# EAGLE design LIDAR_Breakout_V1.1 (EAGLE 9.2.2)
AUTHORS: Austin Keener, Peter Wilson, Johannes Kunz, Mukund Pandiri; REVISION: 1.0; SCH_DESC: Ethernet Breakout Board for Lidar Lite 3 Modules; TEAM: RoboRacing; TITLE: Lidar_Breakout
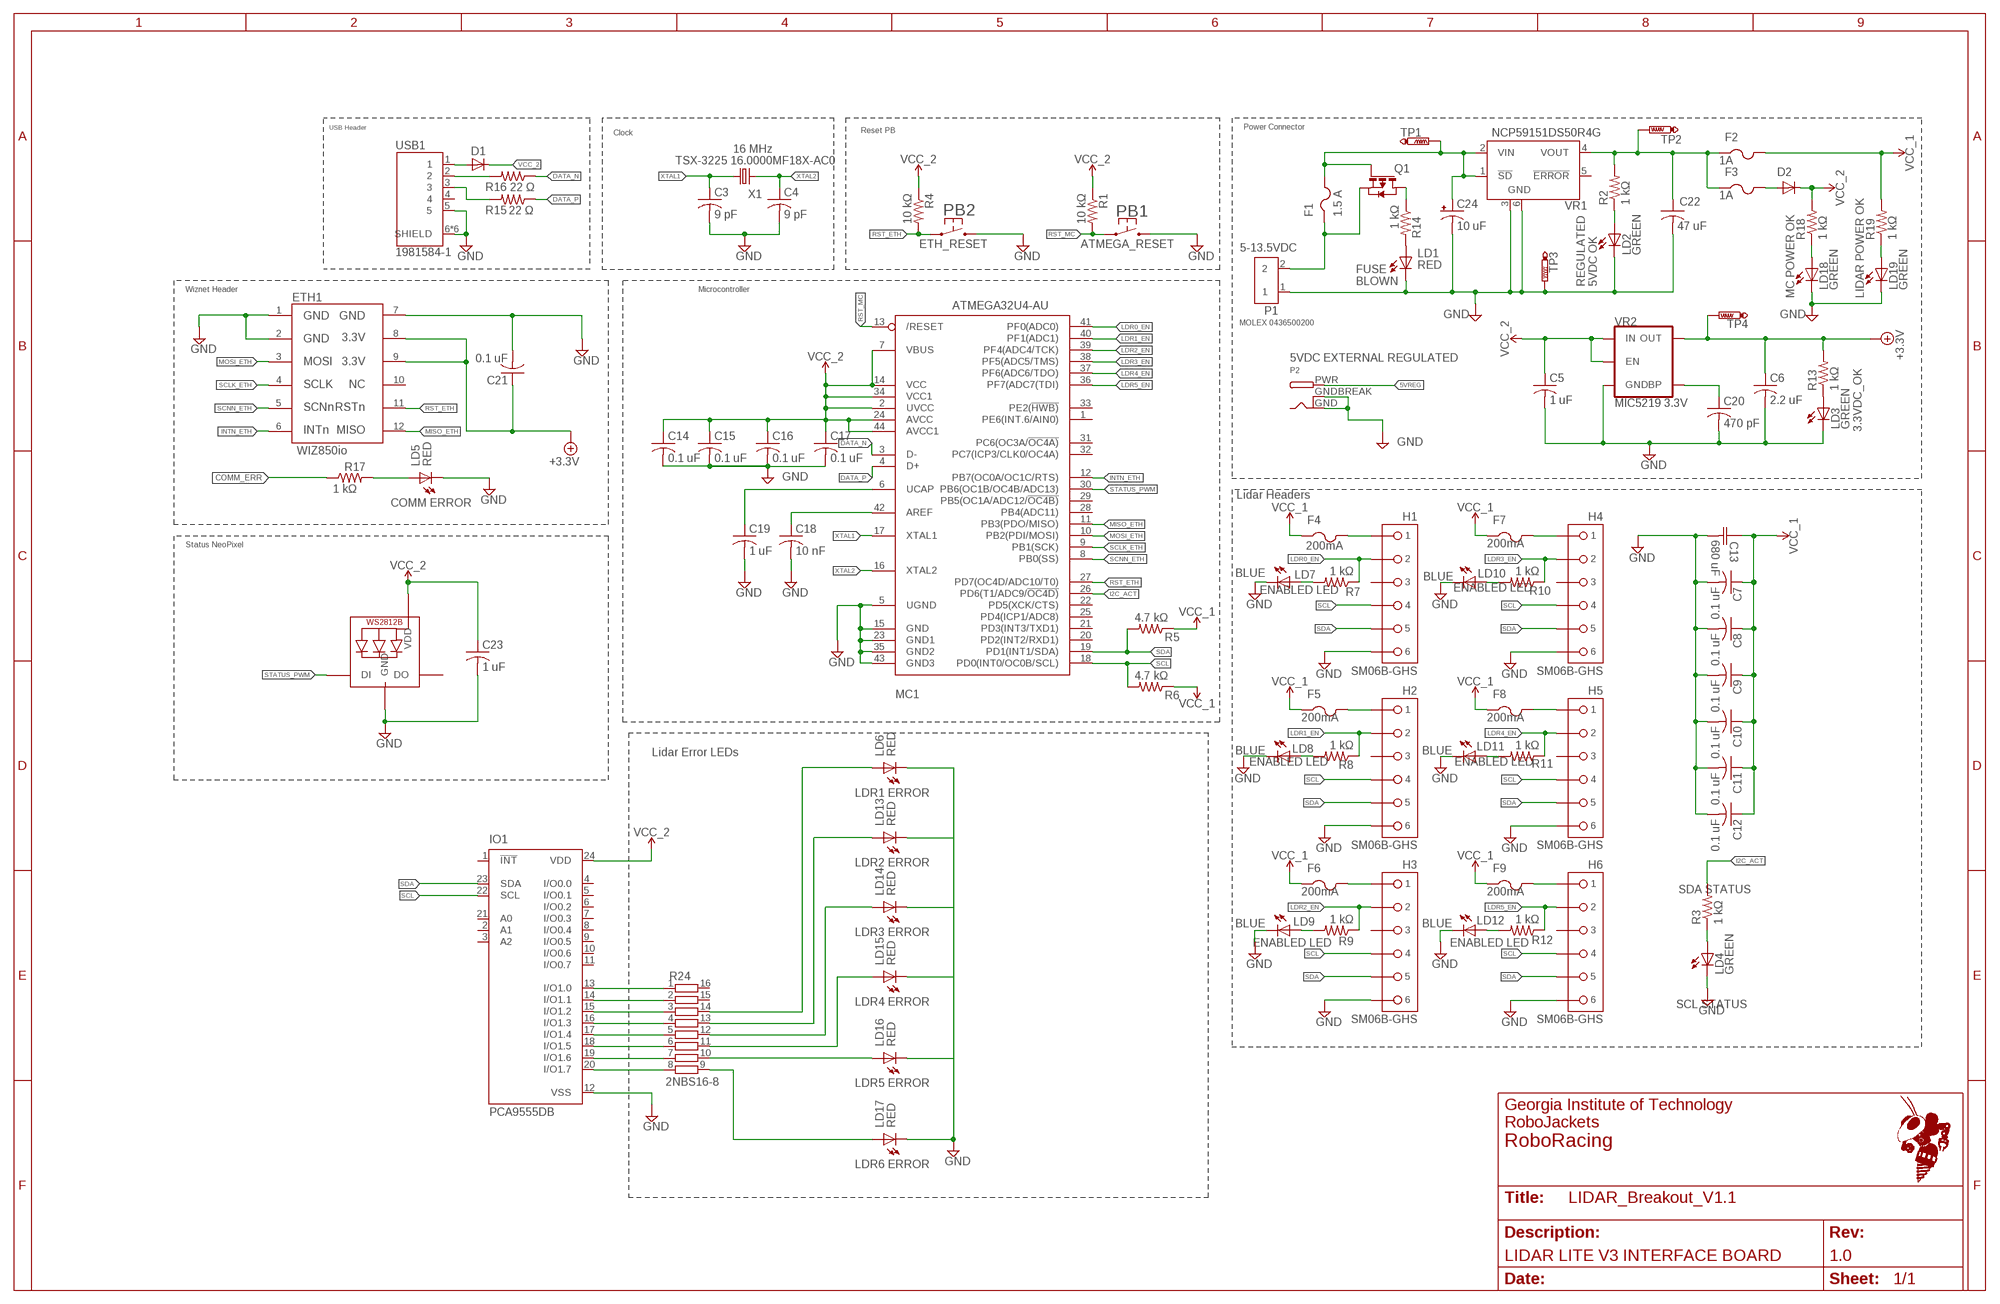
[diagram p0: schematic, sheet 1]
FRAME1 (FRAME_B_L): SCH_DESC: LIDAR LITE V3 INTERFACE BOARD

## Parts
C3  9 pF  C-USC0603  [C0603]
C4  9 pF  C-USC0603  [C0603]
C5  1 uF  C-USC0603  [C0603]
C6  2.2 uF  C-USC0603  [C0603]
C7  0.1 uF  C-USC0603  [C0603]
C8  0.1 uF  C-USC0603  [C0603]
C9  0.1 uF  C-USC0603  [C0603]
C10  0.1 uF  C-USC0603  [C0603]
C11  0.1 uF  C-USC0603  [C0603]
C12  0.1 uF  C-USC0603  [C0603]
C13  680 uF  EEE-FTJ681XAP  [CAP_PAN_EEE_D8]
C14  0.1 uF  C-USC0603  [C0603]
C15  0.1 uF  C-USC0603  [C0603]
C16  0.1 uF  C-USC0603  [C0603]
C17  0.1 uF  C-USC0603  [C0603]
C18  10 nF  C-USC0603  [C0603]
C19  1 uF  C-USC0603  [C0603]
C20  470 pF  C-USC0603  [C0603]
C21  0.1 uF  C-USC0603  [C0603]
C22  47 uF  C-USC0805  [C0805]
C23  1 uF  C-USC0603  [C0603]
C24  10 uF  CPOL-USE2-5  [E2-5]
D1  DIODE-DO-214AC  [DO-214AC]
D2  DIODE-DO-214AC  [DO-214AC]
ETH1  WIZ850IO  [WIZ850IO]
F1  1.5 A  PTCFUSE-1812  [1812]
F2  1A  PTCFUSE-1206  [R1206]
F3  1A  PTCFUSE-1206  [R1206]
F4  200mA  PTCFUSE-1206  [R1206]
F5  200mA  PTCFUSE-1206  [R1206]
F6  200mA  PTCFUSE-1206  [R1206]
F7  200mA  PTCFUSE-1206  [R1206]
F8  200mA  PTCFUSE-1206  [R1206]
F9  200mA  PTCFUSE-1206  [R1206]
H1  SM06B-GHS  [SM06B-GHS]
H2  SM06B-GHS  [SM06B-GHS]
H3  SM06B-GHS  [SM06B-GHS]
H4  SM06B-GHS  [SM06B-GHS]
H5  SM06B-GHS  [SM06B-GHS]
H6  SM06B-GHS  [SM06B-GHS]
IO1  PCA9555DB  [SSOP24]
LD1  RED  LED-SMD-RED  [CHIP-LED0603]
LD2  GREEN  LEDCHIP-LED0603  [CHIP-LED0603]
LD3  GREEN  LEDCHIP-LED0603  [CHIP-LED0603]
LD4  GREEN  LEDCHIP-LED0603  [CHIP-LED0603]
LD5  RED  LED-SMD-RED  [CHIP-LED0603]
LD6  RED  LED-SMD-RED  [CHIP-LED0603]
LD7  BLUE  LEDCHIP-LED0603  [CHIP-LED0603]
LD8  BLUE  LEDCHIP-LED0603  [CHIP-LED0603]
LD9  BLUE  LEDCHIP-LED0603  [CHIP-LED0603]
LD10  BLUE  LEDCHIP-LED0603  [CHIP-LED0603]
LD11  BLUE  LEDCHIP-LED0603  [CHIP-LED0603]
LD12  BLUE  LEDCHIP-LED0603  [CHIP-LED0603]
LD13  RED  LED-SMD-RED  [CHIP-LED0603]
LD14  RED  LED-SMD-RED  [CHIP-LED0603]
LD15  RED  LED-SMD-RED  [CHIP-LED0603]
LD16  RED  LED-SMD-RED  [CHIP-LED0603]
LD17  RED  LED-SMD-RED  [CHIP-LED0603]
LD18  GREEN  LEDCHIP-LED0603  [CHIP-LED0603]
LD19  GREEN  LEDCHIP-LED0603  [CHIP-LED0603]
LED1  WS2812B5050  [WS2812B]
MC1  ATMEGA32U4-AU  [TQFP44]
P1  MOLEX 0436500200  0436500200  [MOLEX_0436500200]
P2  DCBARRELPTH  [DCJACK_2MM_PTH]
PB1  ATMEGA_RESET  RESET_PB_RA  [RESET_PB_RA]
PB2  ETH_RESET  RESET_PB_RA  [RESET_PB_RA]
Q1  PMOS  [SOT-23-3]
R1  10 kΩ  R-US_R0603  [R0603]
R2  1 kΩ  R-US_R0603  [R0603]
R3  1 kΩ  R-US_R0603  [R0603]
R4  10 kΩ  R-US_R0603  [R0603]
R5  4.7 kΩ  R-US_R0603  [R0603]
R6  4.7 kΩ  R-US_R0603  [R0603]
R7  1 kΩ  R-US_R0603  [R0603]
R8  1 kΩ  R-US_R0603  [R0603]
R9  1 kΩ  R-US_R0603  [R0603]
R10  1 kΩ  R-US_R0603  [R0603]
R11  1 kΩ  R-US_R0603  [R0603]
R12  1 kΩ  R-US_R0603  [R0603]
R13  1 kΩ  R-US_R0603  [R0603]
R14  1 kΩ  R-US_R0603  [R0603]
R15  22 Ω  R-US_R0603  [R0603]
R16  22 Ω  R-US_R0603  [R0603]
R17  1 kΩ  R-US_R0603  [R0603]
R18  1 kΩ  R-US_R0603  [R0603]
R19  1 kΩ  R-US_R0603  [R0603]
R24  2NBS16-8  [SO16]
TP1  PTR1B1,27  [B1,27]
TP2  PTR1B1,27  [B1,27]
TP3  PTR1PAD1-13  [P1-13]
TP4  PTR1B1,27  [B1,27]
USB1  1981584-1  [TE_1981584-1]
VR1  NCP59151DS50R4G  LP3963ES-5.0  [TO263-5]
VR2  MIC5219 3.3V  V_REG_MIC52193.3V  [SOT23-5]
X1  TSX-3225 16.0000MF18X-AC0  XTAL-3.2X2.5  [XTAL-3.2X2.5]

## Nets
5VREG: C22.1 F2.1 F3.1 P2.PWR R2.2 TP2.TP VR1.4(VOUT)
+3.3V: C6.1 C21.1 ETH1.8 ETH1.9 R13.2 TP4.TP VR2.5(OUT)
AREF: C18.1 MC1.42(AREF)
COMM_ERR: R17.1
DATA_N [diff]: MC1.3(D-) R16.1
DATA_P [diff]: MC1.4(D+) R15.1
GND: C3.2 C4.2 C5.2 C6.2 C7.2 C8.2 C9.2 C10.2 C11.2 C12.2 C13.2 C14.2 C15.2 C16.2 C17.2 C18.2 C19.2 C20.2 C21.2 C22.2 C23.2 C24.- ETH1.1 ETH1.2 ETH1.7 H1.P$8 H2.P$8 H3.P$8 H4.P$8 H5.P$8 H6.P$8 IO1.12(VSS) LD1.C(K) LD2.C LD3.C LD4.C LD5.C(K) LD6.C(K) LD7.C LD8.C LD9.C LD10.C LD11.C LD12.C LD17.C(K) LD18.C LD19.C LED1.3-GND(GND) MC1.5(UGND) MC1.15(GND) MC1.23(GND1) MC1.35(GND2) MC1.43(GND3) P1.1 P2.GND P2.GNDBREAK PB1.P$3 PB2.P$3 TP3.TP USB1.5 USB1.6(SHIELD) USB1.7(SHIELD) USB1.8(SHIELD) USB1.9(SHIELD) USB1.10(SHIELD) USB1.11(SHIELD) VR1.3(GND) VR1.6(GND) VR2.2(GND)
I2C_ACT: MC1.26(PD6(T1/ADC9/!OC4D)) R3.2
INTN_ETH: ETH1.6 MC1.12(PB7(OC0A/OC1C/RTS))
LDR0_EN: H1.P$4 MC1.41(PF0(ADC0)) R7.1
LDR0_LED: LD7.A R7.2
LDR1_EN: H2.P$4 MC1.40(PF1(ADC1)) R8.1
LDR1_LED: LD8.A R8.2
LDR2_EN: H3.P$4 MC1.39(PF4(ADC4/TCK)) R9.1
LDR2_ERR: LD13.A R24.13
LDR2_LED: LD9.A R9.2
LDR3_EN: H4.P$4 MC1.38(PF5(ADC5/TMS)) R10.1
LDR3_LED: LD10.A R10.2
LDR4_EN: H5.P$4 MC1.37(PF6(ADC6/TDO)) R11.1
LDR4_LED: LD11.A R11.2
LDR5_EN: H6.P$4 MC1.36(PF7(ADC7(TDI)) R12.1
LDR5_LED: LD12.A R12.2
LDR6_ERR: LD6.A LD14.A LD15.A LD16.A LD17.A R24.9 R24.10 R24.11 R24.12 R24.14
MISO_ETH: ETH1.12 MC1.11(PB3(PDO/MISO))
MOSI_ETH: ETH1.3 MC1.10(PB2(PDI/MOSI))
N$1: D1.A USB1.1
N$2: LD4.A R3.1
N$3: LD2.A R2.1
N$4: Q1.3(D) R14.1
N$5: LD3.A R13.1
N$6: LD1.A R14.2
N$7: D2.A F3.2
N$8: R16.2 USB1.2
N$9: LD5.A R17.2
N$10: LD15.C(K)
N$11: LD18.A R18.1
N$12: LD19.A R19.1
N$16: LD16.C(K)
N$18: LD14.C(K)
N$19: LD13.C(K)
N$20: IO1.13(I/O1.0) R24.1
N$21: IO1.14(I/O1.1) R24.2
N$22: IO1.15(I/O1.2) R24.3
N$23: R15.2 USB1.3
N$24: IO1.16(I/O1.3) R24.4
N$25: IO1.17(I/O1.4) R24.5
N$26: IO1.18(I/O1.5) R24.6
N$27: IO1.19(I/O1.6) R24.7
N$28: IO1.20(I/O1.7) R24.8
N$31: C20.1 VR2.4(BP)
RST_ETH: ETH1.11 MC1.27(PD7(OC4D/ADC10/T0)) PB2.P$1 R4.2
RST_MC: MC1.13(/RESET) PB1.P$1 R1.2
SCL: H1.P$6 H2.P$6 H3.P$6 H4.P$6 H5.P$6 H6.P$6 IO1.22(SCL) MC1.18(PD0(INT0/OC0B/SCL)) R6.2
SCLK_ETH: ETH1.4 MC1.9(PB1(SCK))
SCNN_ETH: ETH1.5 MC1.8(PB0(SS))
SDA: H1.P$7 H2.P$7 H3.P$7 H4.P$7 H5.P$7 H6.P$7 IO1.23(SDA) MC1.19(PD1(INT1/SDA)) R5.2
STATUS_PWM: LED1.4-DIN(DI) MC1.30(PB6(OC1B/OC4B/ADC13))
UCAP: C19.1 MC1.6(UCAP)
UVCC: F1.1 P1.2 Q1.2(S)
VCC_1: C7.1 C8.1 C9.1 C10.1 C11.1 C12.1 C13.1 F2.2 F4.1 F5.1 F6.1 F7.1 F8.1 F9.1 R5.1 R6.1 R19.2
VCC_2: C5.1 C14.1 C15.1 C16.1 C17.1 C23.1 D1.C D2.C IO1.24(VDD) LED1.1-VDD(VDD) MC1.2(UVCC) MC1.7(VBUS) MC1.14(VCC) MC1.24(AVCC) MC1.34(VCC1) MC1.44(AVCC1) R1.1 R4.1 R18.2 VR2.1(IN) VR2.3(EN)
VCC_LDR0: F4.2 H1.P$3
VCC_LDR1: F5.2 H2.P$3
VCC_LDR2: F6.2 H3.P$3
VCC_LDR3: F7.2 H4.P$3
VCC_LDR4: F8.2 H5.P$3
VCC_LDR5: F9.2 H6.P$3
VIN: C24.+ F1.2 Q1.1(G) TP1.TP VR1.1(!SD) VR1.2(VIN)
XTAL1: C3.1 MC1.17(XTAL1) X1.1
XTAL2: C4.1 MC1.16(XTAL2) X1.3
Unconnected: ETH1.10 H1.P$5 H2.P$5 H3.P$5 H4.P$5 H5.P$5 H6.P$5 IO1.1(!INT) IO1.2(A1) IO1.3(A2) IO1.4(I/O0.0) IO1.5(I/O0.1) IO1.6(I/O0.2) IO1.7(I/O0.3) IO1.8(I/O0.4) IO1.9(I/O0.5) IO1.10(I/O0.6) IO1.11(I/O0.7) IO1.21(A0) LED1.2-DOUT(DO) MC1.1(PE6(INT.6/AIN0)) MC1.20(PD2(INT2/RXD1)) MC1.21(PD3(INT3/TXD1)) MC1.22(PD5(XCK/CTS)) MC1.25(PD4(ICP1/ADC8)) MC1.28(PB4(ADC11)) MC1.29(PB5(OC1A/ADC12/!OC4B)) MC1.31(PC6(OC3A/!OC4A)) MC1.32(PC7(ICP3/CLK0/OC4A)) MC1.33(PE2(!HWB)) R24.15 R24.16 USB1.4 VR1.5(!ERROR)

## Notes on the sheet
- USB Header | Power Connector
- Reset PB
- Clock
- 16 MHz
- 5-13.5VDC
- FUSE
  BLOWN
- REGULATED
  5VDC OK
- Wiznet Header | Microcontroller
- MC POWER OK | LIDAR POWER OK
- 5VDC EXTERNAL REGULATED
- 3.3VDC_OK
- Lidar Headers
- COMM ERROR
- Status NeoPixel
- ENABLED LED | ENABLED LED
- Lidar Error LEDs
- ENABLED LED | ENABLED LED
- LDR1 ERROR
- LDR2 ERROR
- SDA STATUS
- LDR3 ERROR
- ENABLED LED | ENABLED LED
- LDR4 ERROR | SCL STATUS
- LDR5 ERROR
- LDR6 ERROR

## Library data of the parts
C3-C12 C14-C21 = resistor:C-US: CAPACITOR, American symbol
C13 = 680uF_Elect_Cap:EEE-FTJ681XAP; MANUFACTURER_PART_NUMBER: EEEFTJ681XAP; VENDOR: Panasonic
C22 C23 = rcl:C-US: CAPACITOR, American symbol; SPICEPREFIX: C
C24 = rcl:CPOL-US: POLARIZED CAPACITOR, American symbol; SPICEPREFIX: C
D1 D2 = RoboJackets-Diodes:DIODE-: DIODE
ETH1 = WIZ850io:WIZ850IO
F1-F9 = adafruit:PTCFUSE: PTC fuses, resettable thermistors
H1-H6 = RoboJackets-Connectors:SM06B-GHS
IO1 = micro-philips:PCA9555: 16-bit I2C and SMBus I/O port with interrupt Source: PCA9555_5.pdf; MPN: PCA9555DB; OC_FARNELL: 1408295; OC_NEWARK: 63K6063
LD1 LD5 LD6 LD13-LD17 = RoboJackets-LEDs:LED-SMD; DIGIKEY: 160-1447-1-ND; MPN: LTST-C191KRKT
LD2-LD4 LD7-LD12 LD18 LD19 = led:LED: LED OSRAM: - CHIPLED LG R971, LG N971, LY N971, LG Q971, LY Q971, LO R971, LY R971 LH N974, LH R974 LS Q976, LO Q976, LY Q976 LO Q996 - Hyper CHIPLED LW Q18S LB Q993, LB Q99A, LB R99A - SideLED LS A670, LO A670, LY A670, LG A670, LP A670 LB A673, LV A673, LT A673, LW A673 LH A674 LY A675 LS A676, LA A676, LO A676, LY A676, LW A676 LS A679, LY A679, LG A679 - Hyper Micro SIDELED® LS Y876, LA Y876, LO Y876, LY Y876 LT Y87S - SmartLED LW L88C, LW L88S LB L89C, LB L89S, LG L890 LS L89K, LO L89K, LY L89K LS L896, LA L896, LO L896, LY L896 - TOPLED LS T670, LO T670, LY T670, LG T670, LP T670 LSG T670, LSP T670, LSY T670, LOP T670, LYG T670 LG T671, LOG T671, LSG T671 LB T673, LV T673, LT T673, LW T673 LH T674 LS T676, LA T676, LO T676, LY T676, LB T676, LH T676, LSB T676, LW T676 LB T67C, LV T67C, LT T67C, LS T67K, LO T67K, LY T67K, LW E67C LS E67B, LA E67B, LO E67B, LY E67B, LB E67C, LV E67C, LT E67C LW T67C LS T679, LY T679, LG T679 LS T770, LO T770, LY T770, LG T770, LP T770 LB T773, LV T773, LT T773, LW T773 LH T774 LS E675, LA E675, LY E675, LS T675 LS T776, LA T776, LO T776, LY T776, LB T776 LHGB T686 LT T68C, LB T68C - Hyper Mini TOPLED® LB M676 - Mini TOPLED Santana® LG M470 LS M47K, LO M47K, LY M47K Source: http://www.osram.convergy.de LUXEON: - LUMILED® LXK2-PW12-R00, LXK2-PW12-S00, LXK2-PW14-U00, LXK2-PW14-V00 LXK2-PM12-R00, LXK2-PM12-S00, LXK2-PM14-U00 LXK2-PE12-Q00, LXK2-PE12-R00, LXK2-PE12-S00, LXK2-PE14-T00, LXK2-PE14-U00 LXK2-PB12-K00, LXK2-PB12-L00, LXK2-PB12-M00, LXK2-PB14-N00, LXK2-PB14-P00, LXK2-PB14-Q00 LXK2-PR12-L00, LXK2-PR12-M00, LXK2-PR14-Q00, LXK2-PR14-R00 LXK2-PD12-Q00, LXK2-PD12-R00, LXK2-PD12-S00 LXK2-PH12-R00, LXK2-PH12-S00 LXK2-PL12-P00, LXK2-PL12-Q00, LXK2-PL12-R00 Source: www.luxeon.com KINGBRIGHT: KA-3528ASYC Source: www.kingbright.com
LED1 = adafruit:WS2812B
MC1 = adafruit:ATMEGA32U4: http://www.ladyada.net/library/eagle
P1 = 0436500200:0436500200: CONN HEADER 2POS 3MM RT ANG TIN; DESCRIPTION: Conn Power HDR 2 POS 3mm Solder RA Thru-Hole 2 Terminal 1 Port Micro-Fit 3.0Ã¢âÂ¢ Tray; MF: Molex, LLC; MP: 0436500200; PACKAGE: None
P2 = adafruit:DCBARREL: 2.0mm DC Barrel Jack DCJACK_2MM_PTH - Through Hole Jack (4UConnector: 05537)
PB1 PB2 = RoboJackets-Switches:RESET_PB_RA
Q1 = RoboJackets-Discrete:PMOS
R1-R19 = rcl:R-US_: RESISTOR, American symbol; SPICEPREFIX: R
R24 = resistor-bourns:2NBS16-8: BOURNS RESISTOR NETWORK; OC_FARNELL: unknown; OC_NEWARK: unknown
TP1-TP4 = testpad:PTR1: TEST PIN
USB1 = 1981584-1:1981584-1: CONN RCPT MICRO USB TYPE AB; CENTERLINE_PITCH: .65 mm[.025 in]; COMMENT: 1981584-1; DESCRIPTION: REC TYPE AB ASSY _Au_ MICRO USB; DIGI-KEY_PART_NUMBER: A97799CT-ND; DIGI-KEY_PURCHASE_URL: https://www.digikey.com/product-detail/en/te-connectivity-amp-connectors/1981584-1/A97799CT-ND/1786249?utm_source=snapeda&utm_medium=aggregator&utm_campaign=symbol; MF: TE Connectivity; MP: 1981584-1; NUMBER_OF_POSITIONS: 5; PACKAGE: None; PRODUCT_TYPE: Connector; TE_PURCHASE_URL: https://www.te.com/usa-en/product-1981584-1.html?te_bu=Cor&te_type=disp&te_campaign=seda_glo_cor-seda-global-disp-prtnr-fy19-seda-model-bom-cta_sma-317_1&elqCampaignId=32493
VR1 = linear:LP3963?*: 3A Fast Ultra Low Dropout Linear Regulator Source: http://cache.national.com/ds/LP/LP3963.pdf
VR2 = SparkFun-IC-Power:V_REG_MIC5219: V_REG MIC5219 Standard 3.3V and 5V 500mA LDO voltage regulator in SOT-23 layout. Micrel part MIC5219. BP (by-pass) pin is used to lower output noise with 470pF cap, may be left open.; PROD_ID: VREG-09872
X1 = RoboJackets-FreqGen:XTAL

## Net classes
0 default: width 0.203 mm
2 diff: width 0.406 mm

## Board
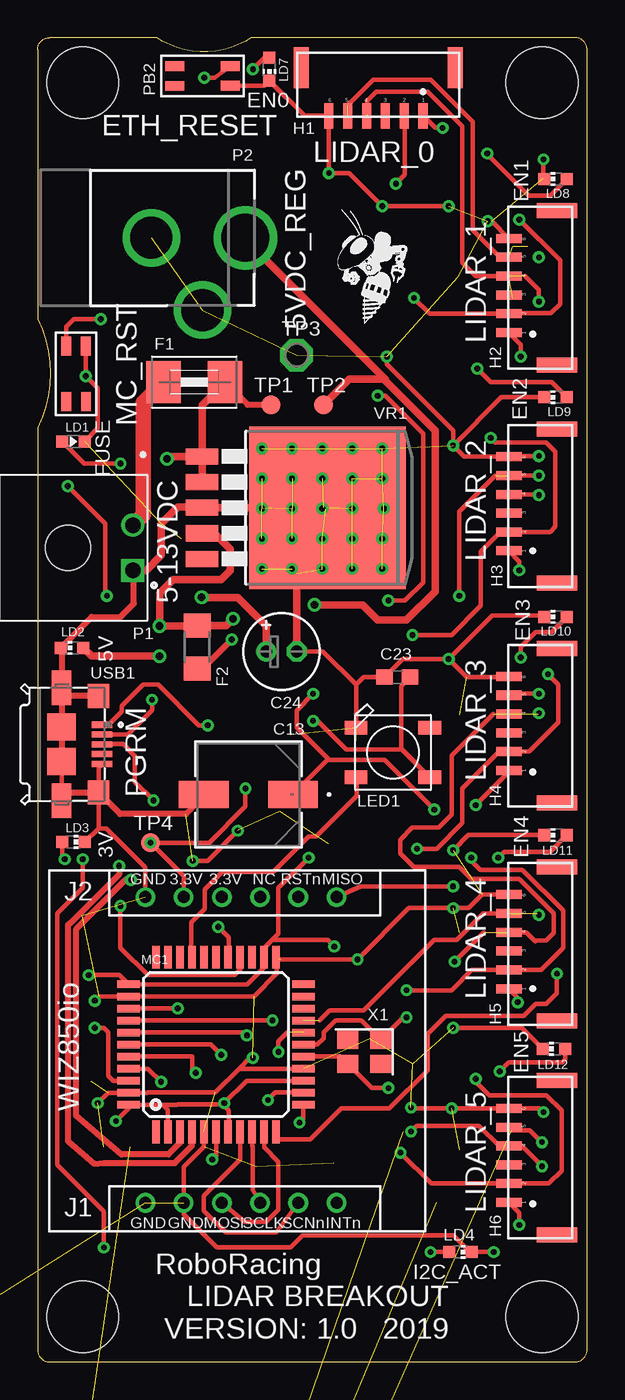
[diagram p1: board, top side]
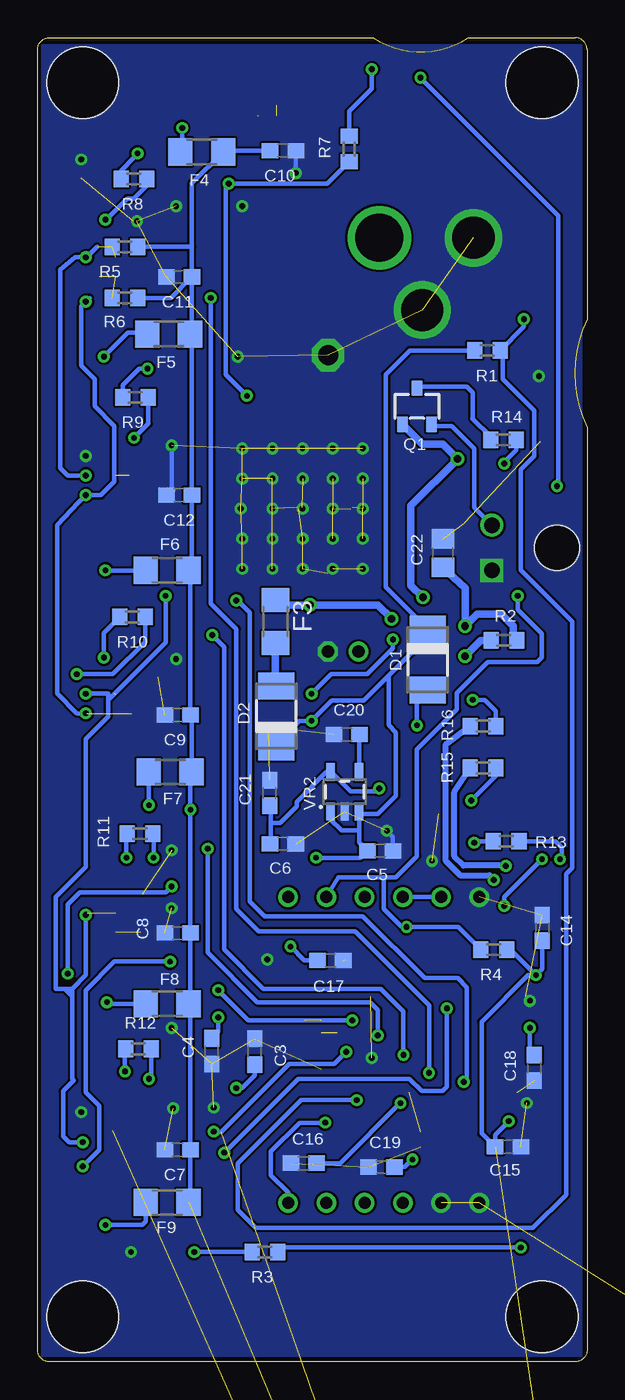
[diagram p2: board, bottom side, seen from below]

Size 36.5 x 88 mm. Coordinates in mm from the lower left corner, seen from the top.
Outline: 0.8,0 35.7,0 arc90 36.5,0.8 36.5,87.2 arc90 35.7,88 14.2,88 arc-67 7.9,88 0.8,88 arc90 0,87.2 0,69.3 arc-52 0,62.1 0,0.8 arc90 0.8,0
Copper layers (1*16): Top 0.0356mm / dielectric 63mil / Bottom 0.0356mm
Design rules "RJ2LayerDRU": minimum track width 6mil, minimum drill 15mil, track to track 6mil, track to pad 6mil, pad to pad 6mil, via to via 6mil, smd to smd 6mil, copper to edge 0mil, drill to drill 6mil, minimum pad ring 10mil, minimum via ring 8mil, stop-mask expansion 4mil, vias tented up to drill 0mil, thermal gap 10mil
Holes 4.76 mm at 3,3 33.5,3 33.5,85 3,85

### Footprints (pad centres in the part's own frame; a part is rotated, then mirrored left to right if it is on the bottom)
C0603 = smd 1.1 x 1: 1 -0.85,0; 2 0.85,0
CAP_PAN_EEE_D8 = smd 3.302 x 1.778: 1 -2.959,0; 2 2.959,0
C0805 = smd 1.3 x 1.5: 1 -0.95,0; 2 0.95,0
E2-5 = drill 0.813 pad 1.27: + -1.016,0 | drill 0.813 pad 1.27 octagon: - 1.016,0
DO-214AC = smd 1.8 x 2.4: A 2.025,0; C -2.025,0
WIZ850IO = drill 0.8: 1 6.4,1.9; 2 8.94,1.9; 3 11.48,1.9; 4 14.02,1.9; 5 16.56,1.9; 6 19.1,1.9; 7 6.4,22.22; 8 8.94,22.22; 9 11.48,22.22; 10 14.02,22.22; 11 16.56,22.22; 12 19.1,22.22
1812 = smd 2.286 x 2.794: 1 -2.046,0; 2 2.046,0
R1206 = smd 1.6 x 1.803: 1 -1.422,0; 2 1.422,0
SM06B-GHS = smd 1 x 2.7: P$1 0.25,1; P$2 10.5,1 | smd 0.6 x 1.7: P$3 2.4,4.2; P$4 3.65,4.2; P$5 4.9,4.2; P$6 6.15,4.2; P$7 7.4,4.2; P$8 8.65,4.2
SSOP24 = smd 0.4 x 1.2: 1 -3.575,-3.42; 2 -2.925,-3.42; 3 -2.275,-3.42; 4 -1.625,-3.42; 5 -0.975,-3.42; 6 -0.325,-3.42; 7 0.325,-3.42; 8 0.975,-3.42; 9 1.625,-3.42; 10 2.275,-3.42; 11 2.925,-3.42; 12 3.575,-3.42; 13 3.575,3.42; 14 2.925,3.42; 15 2.275,3.42; 16 1.625,3.42; 17 0.975,3.42; 18 0.325,3.42; 19 -0.325,3.42; 20 -0.975,3.42; 21 -1.625,3.42; 22 -2.275,3.42; 23 -2.925,3.42; 24 -3.575,3.42
CHIP-LED0603 = smd 0.8 x 0.8: A 0,-0.75; C 0,0.75
WS2812B = smd 1.5 x 0.9: 1-VDD 2.45,-1.65; 2-DOUT 2.45,1.65; 3-GND -2.45,1.65; 4-DIN -2.45,-1.65
TQFP44 = smd 1.5 x 0.5: 1 -5.8,4; 2 -5.8,3.2; 3 -5.8,2.4; 4 -5.8,1.6; 5 -5.8,0.8; 6 -5.8,0; 7 -5.8,-0.8; 8 -5.8,-1.6; 9 -5.8,-2.4; 10 -5.8,-3.2; 11 -5.8,-4; 23 5.8,-4; 24 5.8,-3.2; 25 5.8,-2.4; 26 5.8,-1.6; 27 5.8,-0.8; 28 5.8,0; 29 5.8,0.8; 30 5.8,1.6; 31 5.8,2.4; 32 5.8,3.2; 33 5.8,4 | smd 0.5 x 1.5: 12 -4,-5.8; 13 -3.2,-5.8; 14 -2.4,-5.8; 15 -1.6,-5.8; 16 -0.8,-5.8; 17 0,-5.8; 18 0.8,-5.8; 19 1.6,-5.8; 20 2.4,-5.8; 21 3.2,-5.8; 22 4,-5.8; 34 4,5.8; 35 3.2,5.8; 36 2.4,5.8; 37 1.6,5.8; 38 0.8,5.8; 39 0,5.8; 40 -0.8,5.8; 41 -1.6,5.8; 42 -2.4,5.8; 43 -3.2,5.8; 44 -4,5.8
MOLEX_0436500200 = drill 1.02 square: 1 1.5,4.32 | drill 1.02: 2 -1.5,4.32 | hole 3: 0,0
DCJACK_2MM_PTH = drill 2.8: GND 0,7.35; GNDBREAK 4.8,10.75 | drill 3.2: PWR 0,13.6
RESET_PB_RA = smd 1.27 x 0.66: P$1 0.9,0.7; P$3 0.9,2 | smd 1.27 x 0.635: P$2 4.6,0.7; P$4 4.6,2
SOT-23-3 = smd 0.7 x 1: 1 -0.95,-1.2; 2 0.95,-1.2; 3 0,1.2
R0603 = smd 1 x 1.1: 1 -0.85,0; 2 0.85,0
SO16 = smd 0.6 x 2.2: 1 -4.445,-2.6; 2 -3.175,-2.6; 3 -1.905,-2.6; 4 -0.635,-2.6; 5 0.635,-2.6; 6 1.905,-2.6; 7 3.175,-2.6; 8 4.445,-2.6; 9 4.445,2.6; 10 3.175,2.6; 11 1.905,2.6; 12 0.635,2.6; 13 -0.635,2.6; 14 -1.905,2.6; 15 -3.175,2.6; 16 -4.445,2.6
B1,27 = smd 1.27 x 1.27: TP 0,0
P1-13 = drill 1.321 pad 2.159 octagon: TP 0,0
TE_1981584-1 = smd 0.4 x 1.35: 1 -1.3,2.675; 2 -0.65,2.675; 3 0,2.675; 4 0.65,2.675; 5 1.3,2.675 | smd 1.6 x 1.4: 6 -3.2,2.45; 7 3.2,2.45 | smd 2.3 x 1.3: 8 3.75,0; 9 -3.75,0 | smd 1.8 x 1.9: 10 -1.15,0; 11 1.15,0
TO263-5 = smd 1.067 x 2.159: 1 -3.404,-5.791; 2 -1.702,-5.791; 3 0,-5.791; 4 1.702,-5.791; 5 3.404,-5.791 | smd 10.8 x 10.41: 6 0,2.54
SOT23-5 = smd 0.55 x 1.2: 1 -0.95,-1.3; 2 0,-1.3; 3 0.95,-1.3; 4 0.95,1.3; 5 -0.95,1.3
XTAL-3.2X2.5 = smd 1.4 x 1.2: 1 -1.1,-0.8; 2 1.1,-0.8; 3 1.1,0.8; 4 -1.1,0.8

### Placement (x,y rotation side)
C3  24.93,20.65 270 bottom
C4  22.07,20.62 90 bottom
C5  13.75,33.96 0 bottom
C6  20.2,34.43 0 bottom
C7  27.2,14.1 180 bottom
C8  27.2,28.5 180 bottom
C9  27.2,43 180 bottom
C10  20.2,80.5 0 bottom
C11  27.1,72.1 180 bottom
C12  27.1,57.6 180 bottom
C13  14,37.7 180 top
C14  2.97,28.83 90 bottom
C15  5.25,14.29 0 bottom
C16  18.83,13.21 180 bottom
C17  17.05,26.68 0 bottom
C18  3.52,19.54 270 bottom
C19  13.66,12.95 180 bottom
C20  15.97,41.7 180 bottom
C21  21.09,37.81 90 bottom
C22  9.58,53.74 90 bottom
C23  23.9,45.5 180 top
C24  16.2,47.2 0 top
D1  10.59,46.66 270 bottom
D2  20.65,42.9 90 bottom
ETH1  0.76,8.66 0 top
F1  10.4,65.1 0 top
F2  10.6,47.5 270 top
F3  20.7,49.2 270 bottom
F4  25.6,80.4 180 bottom
F5  27.8,68.3 180 bottom
F6  27.9,52.6 180 bottom
F7  27.7,39.2 180 bottom
F8  27.9,23.8 180 bottom
F9  27.9,10.6 180 bottom
H1  28,87 180 top
H2  35.5,66 90 top
H3  35.5,51.5 90 top
H4  35.5,36.9 90 top
H5  35.5,22.4 90 top
H6  35.5,8.2 90 top
IO1  -2.5,-71.1 0 top  (outside the outline)
LD1  2.38,61.17 270 top
LD2  2.29,47.45 90 top
LD3  2.39,34.55 270 top
LD4  28.1,7.3 270 top
LD5  -6.4,1.3 0 top  (outside the outline)
LD6  -6.4,-8.6 0 top  (outside the outline)
LD7  15.4,85.9 180 top
LD8  34.4,78.6 90 top
LD9  34.4,64.1 90 top
LD10  34.4,49.5 90 top
LD11  34.4,35 90 top
LD12  34.3,20.8 90 top
LD13  -6.4,-19 0 top  (outside the outline)
LD14  -6.4,-29.4 0 top  (outside the outline)
LD15  -6.4,-39.8 0 top  (outside the outline)
LD16  -6.4,-50.2 0 top  (outside the outline)
LD17  -6.4,-60.6 0 top  (outside the outline)
LD18  -11.3,-82.6 0 top  (outside the outline)
LD19  -16.2,-87.5 0 top  (outside the outline)
LED1  23.6,40.5 0 top
MC1  11.85,21.09 90 top
P1  2.01,54.1 270 top
P2  0.2,74.7 270 top
PB1  1.2,68.4 270 top
PB2  13.7,86.8 180 top
Q1  11.3,63.5 0 bottom
R1  6.62,67.21 0 bottom
R2  5.53,47.95 0 bottom
R3  21.4,7.3 0 bottom
R4  6.2,27.4 180 bottom
R5  30.7,74.1 180 bottom
R6  30.7,70.7 180 bottom
R7  15.8,80.6 90 bottom
R8  30.1,78.6 180 bottom
R9  30,64.1 180 bottom
R10  30.2,49.5 180 bottom
R11  29.7,35.1 180 bottom
R12  29.8,20.8 180 bottom
R13  5.37,34.59 180 bottom
R14  5.56,61.28 0 bottom
R15  6.91,39.47 0 bottom
R16  6.91,42.25 0 bottom
R17  -7.3,-2.5 0 top  (outside the outline)
R18  -12.2,-86.4 0 top  (outside the outline)
R19  -17.1,-91.3 0 top  (outside the outline)
R24  -1.9,-80.1 0 top  (outside the outline)
TP1  15.5,63.6 0 top
TP2  19,63.6 0 top
TP3  17.2,66.9 0 top
TP4  7.5,34.5 0 top
U$1  ROBOBUZZ0.4X  [ROBOBUZZ_0.4X]  21.7,69 0 top
USB1  1.59,41.04 270 top
VR1  16.71,56.76 270 top
VR2  16.1,37.89 0 bottom
X1  21.7,20.6 180 top

### Tracks (layer width: path | path; a pad name or v marks a point on that pad's centre or on a via)
5VREG  (via drill 0.5)
  Top 0.508: VR1.4 10.88,55.1 11.7,55.1 12.8,54 12.8,52.6 12.2,52 9,52 8.1,51.1 v8.1,48.9 10.58,48.9 F2.1 12.52,48.92 v12.99,49.39 | 23.1,65.3 23.1,65.2 26.4,61.9 26.4,51.2 24.5,49.3 22.6,49.3 21.6,50.3 v18.4,50.3 | 23.1,65.3 20.7,65.3 TP2.TP | 23.1,65.3 13.8,74.6 P2.PWR
  Bottom 0.406: F3.1 20.38,50.3
  Bottom 0.508: v12.99,49.39 13.9,50.3 v18.4,50.3 20.38,50.3 | R2.2 4.9,48.17 4.9,48.9 5.7,49.7 7.3,49.7 v8.1,48.9 8.1,51.41 C22.1
+3.3V  (via drill 0.38)
  Top 0.305: v13.81,38.11 13.81,36.91 11.4,34.5 TP4.TP 9.7,32.3 ETH1.8
  Bottom 0.305: R13.2 7.41,34.59 TP4.TP | v13.81,38.11 14.01,37.9 15.7,37.9 16.99,39.19 VR2.5 17.31,39.19 19.3,37.2 19.3,36.9 20.4,35.8 21,35.8 | C6.1 21,34.48 21,35.8 | C21.1 21,36.87 21,35.8 | ETH1.8 ETH1.9
  other vias: 7.5,34.5
AREF  (via drill 0.38)
  Top 0.305: MC1.42 5.01,18.69 4.7,19 4.7,21.9 4.4,22.2 v3.8,22.2
  Bottom 0.305: v3.8,22.2 3.8,20.67 C18.1
DATA_N  (via drill 0.38)
  Top 0.406: MC1.3 9.45,14.55 8.68,13.78 5.56,13.78 2.58,16.35 2.58,28.78 5.83,32.03 v6.2,32.03
  Bottom 0.406: R16.1 9.38,41.04 9.38,33.28 8.43,32.33 6.5,32.33 v6.2,32.03
DATA_P  (via drill 0.38)
  Top 0.406: MC1.4 10.25,14.36 9.11,13.22 4.42,13.22 3.75,13.17 2.02,14.66 2.02,29.05 2.15,29.14 5.41,32.41 v5.41,32.95
  Bottom 0.406: R15.1 8.82,37.88 8.82,33.6 8.2,32.98 5.43,32.98 v5.41,32.95
GND  (via drill 0.38)  (63 unrouted)
  Top 0.305: LD12.C 32.15,22.2 v27.6,22.2 | v3.8,24 4.09,24.29 MC1.35 14.39,24.29 15.9,25.8 15.9,26.8 15.92,26.82 | v4,17.2 4.69,17.89 MC1.43 7.29,17.89 7.3,17.9 11.8,17.9 13.39,19.49 | MC1.23 15.92,26.82 | 15.92,26.82 15.98,26.75 v21.25,26.75 24.65,30.15 v27.6,30.15 28.65,30.15 29.55,31.05 H5.P$8 | MC1.5 11.05,14.3 9.7,12.95 ETH1.2 9.7,9.8 11.9,7.6 16.8,7.6 17.6,8.4 27.6,8.4 28.7,7.3 LD4.C v30.3,7.3 | LD11.C 28.6,35 v27.6,34 | H4.P$8 31.35,45.5 28.5,45.5 v27.3,46.7 | v33.6,16.6 33.35,16.85 H6.P$8 v27.5,16.85 24.8,16.85 v24.8,16.9 | PB1.P$3 v3.2,65.5 4,64.7 4,62.04 LD1.C | LD8.C 33.6,78.65 v33.6,79.9 | LED1.3-GND 21.15,45 | 15.6,56.76 15.7,56.66 19.15,56.66 VR1.6 18.96,56.76 v18.9,56.7 | PB2.P$3 15.05,84.8 LD7.C 17.75,82.8 H1.P$8 v19.35,79 20.7,79 v22.9,76.8 v27.3,76.8 | ETH1.7 7.16,32.84 4.54,35.46 4.04,35.46 | 11.09,37.65 C13.2 | C24.- 18.95,47.2 21.15,45 | 13.39,19.49 MC1.15 | v27.6,60.9 28.35,60.15 H3.P$8 31.35,60.2 v33.3,60.2 | 21.15,45 21.65,45.5 C23.2 24.25,46.7 v27.3,46.7 | v27.3,46.7 30.2,49.6 33.55,49.6 LD10.C | v27.6,60.9 27.6,61.9 23.2,66.3 v23.2,66.8 | LD9.C 30.8,64.1 v27.6,60.9 | H2.P$8 30.15,75.8 v29.9,75.8 | 13.39,19.49 14.1,20.2 v14.3,20.2 | USB1.5 4.04,39.52 USB1.7 4.04,35.46 | LD3.C 4.04,35.46 | USB1.11 USB1.8 | v13.3,35.3 11.3,33.3 v10.3,33.3
  Top 0.406: 11.09,37.65 9.84,36.4 5.49,36.4 USB1.7 2.15,37.84 USB1.8 | USB1.11 USB1.10 USB1.9 | USB1.9 1.59,47.39 LD2.C 3.59,49.5 5.5,49.5 6.4,50.4 6.4,52.53 P1.1 | USB1.6 2.15,44.24 USB1.9
  Top 0.508: 15.6,56.76 VR1.3 10.88,56.8 9.3,56.8 8.2,55.7 8.2,53.6 7.2,52.6 P1.1 | C24.- 17.22,52.38 v16.9,52.7
  Bottom 0.305: C10.2 v19.35,79 | 27.6,57.95 v27.6,60.9 | v13.3,35.3 12.9,34.9 C5.2
  Bottom 0.508: C12.2 27.6,57.95
  other vias: 14.9,60.7 16.9,60.7 18.9,60.7 20.9,60.7 14.9,58.7 14.9,56.7 14.9,54.7 14.9,52.7 16.9,54.7 16.9,56.7 20.9,56.7 23,56.7 18.9,54.7 20.9,54.7 22.9,54.7 16.9,58.7 18.9,58.7 20.9,58.7 22.9,58.7 22.9,60.7 18.9,52.7 20.9,52.7 22.9,52.7
  pour Bottom (no thermals): 0.4,0.4 0.4,87.5 36.2,87.5 36.2,0.4
I2C_ACT  (via drill 0.38)
  Top 0.305: v3,33.4 3,31.5 1.3,29.8 1.3,13.1 4.4,10 v4.4,7.6 | v5.5,30.3 5.5,27.5 7.3,25.7 13.1,25.7 13.5,26.1 13.5,26.84 MC1.26
  Bottom 0.305: v5.5,30.3 5.5,30.9 v3,33.4 | R3.2 20.25,7.6 v4.4,7.6
INTN_ETH  (via drill 0.38)
  Top 0.305: MC1.12 17.65,16.15 v17.4,15.9
  Bottom 0.305: v17.4,15.9 19.1,15.9 21,14 21,12.4 19.86,11.26 ETH1.6
LDR0_EN  (via drill 0.38)
  Top 0.305: MC1.41 7.31,19.49 v8.2,18.6 | H1.P$4 24.35,82.9 24.4,82.95 24.4,78.9 v23.8,78.3 | v23.3,50.6 24.4,50.6 25.6,51.8 25.6,61.7 23.1,64.2 v22.6,64.2
  Bottom 0.305: v8.2,18.6 8,18.8 8,24.9 8.6,25.5 10.8,25.5 14.9,29.6 21.4,29.6 22.4,30.6 22.4,49.8 23.2,50.6 v23.3,50.6 | R7.1 17.25,78.3 v23.8,78.3 24,78.3 24,65.6 v22.6,64.2
LDR0_LED  (via drill 0.38)
  Top 0.305: LD7.A 15.05,86.65 v14.3,85.9
  Bottom 0.305: R7.2 15.8,83.1 14.3,84.6 v14.3,85.9
LDR1_EN  (via drill 0.38)
  Top 0.305: MC1.40 10.29,20.29 10.29,19.41 v10.5,19.2 | v32,75.9 34.7,73.2 34.7,70.3 34.1,69.7 31.35,69.7 H2.P$4 26.05,69.65 v25,70.7
  Bottom 0.305: v25,70.7 25,50.4 23.3,48.7 23.3,30.1 21.8,28.6 15.4,28.6 10.5,23.7 v10.5,19.2 | R8.1 29.25,78.15 30.1,77.3 30.55,77.3 31.88,75.97 31.93,75.97 v32,75.9
LDR1_LED  (via drill 0.38)
  Top 0.305: LD8.A 34.05,77.5 32.61,77.5 30.1,80.01 30.1,80.06 v29.86,80.3
  Bottom 0.305: v29.86,80.3 30.1,80.06 30.1,80.01 30.95,79.16 R8.2
LDR2_EN  (via drill 0.38)
  Top 0.305: v12.2,20.4 11.51,21.09 MC1.39 | v24.9,48.3 27.5,48.3 29.45,50.25 29.45,53.85 30.7,55.1 31.25,55.1 H3.P$4 34.05,55.15 34.4,55.5 34.4,60.5 33.8,61.1 30.4,61.1 v30.1,61.4
  Bottom 0.305: v12.2,20.4 12.2,23.3 13.7,24.8 21.5,24.8 24.1,27.4 24.1,47.5 v24.9,48.3 | v30.1,61.4 29.15,62.35 R9.1
LDR2_ERR  (1 unrouted)
LDR2_LED  (via drill 0.38)
  Top 0.305: LD9.A 34.15,65.1 30.1,65.1 v29.2,66
  Bottom 0.305: v29.2,66 29.75,66 30.85,64.9 R9.2
LDR3_EN  (via drill 0.38)
  Top 0.305: v33.9,45.7 34.6,45 34.6,42.5 32.65,40.55 H4.P$4 31.35,40.6 30.7,40.6 28.2,38.1 28.2,35.8 26.5,34.1 v25.2,34.1 | v13.9,21.7 13.71,21.89 MC1.38
  Bottom 0.305: v25.2,34.1 25.2,27.2 21.9,23.9 14.4,23.9 13.9,23.4 v13.9,21.7 | v33.9,45.7 31.5,45.7 29.35,47.85 R10.1
LDR3_LED  (via drill 0.38)
  Top 0.305: v32.1,46.8 32.1,47.5 33.1,48.5 34.15,48.5 LD10.A
  Bottom 0.305: R10.2 32.1,48.45 v32.1,46.8
LDR4_EN  (via drill 0.38)
  Top 0.305: MC1.37 15.59,22.69 v15.6,22.7 | v24.5,24.7 27.5,24.7 28.85,26.05 H5.P$4 33.45,26.05 34.9,27.5 34.9,30 32.2,32.7 29.4,32.7 28.8,33.3 v28.8,33.5
  Bottom 0.305: v15.6,22.7 22.5,22.7 v24.5,24.7 | v28.8,33.5 28.8,35.05 R11.1
LDR4_LED  (via drill 0.38)
  Top 0.305: LD11.A 34.05,33.9 31,33.9 v30.6,33.5
  Bottom 0.305: v30.6,33.5 30.6,35.05 R11.2
LDR5_EN  (via drill 0.38)
  Top 0.305: MC1.36 v9.31,23.49 | v29.1,18.8 29.1,18.6 30,17.7 33.8,17.7 34.8,16.7 34.8,12.7 33.95,11.85 H6.P$4 26.15,11.85 v24.1,13.9
  Bottom 0.305: v9.31,23.49 9.31,18.29 9.6,18 11,18 11.8,18.8 19.2,18.8 v24.1,13.9 | R12.1 28.95,18.95 v29.1,18.8
LDR5_LED  (via drill 0.38)
  Top 0.305: v30.7,19.3 31.3,19.9 34.85,19.9 35.05,20.1 LD12.A
  Bottom 0.305: R12.2 30.7,20.75 v30.7,19.3
LDR6_ERR  (9 unrouted)
MISO_ETH  (via drill 0.38)
  Top 0.305: MC1.11 15.85,14.79 18.1,14.79 20.16,16.84 23.36,16.84 25.9,19.39 25.9,21.8 27.1,23 32.3,23 33.1,23.8 33.8,23.8 34.5,24.5 v34.5,25.8 | ETH1.12 21.45,31.6 v27.6,31.6
  Bottom 0.305: v27.6,31.6 28,31.2 33.7,31.2 34.5,30.4 v34.5,25.8
MOSI_ETH
  Top 0.305: ETH1.3 13.74,9.3 15.2,9.3 16,10.1 16,13.3 15.05,14.25 MC1.10
N$1  (via drill 0.38)
  Top 0.305: v11.3,42.3 10.7,42.3 8,45 7,45 5.6,43.6 5.6,43.23 4.71,42.34 USB1.1
  Bottom 0.305: D1.A 11.3,43.92 v11.3,42.3
N$2  (via drill 0.38)
  Top 0.305: v26.1,7.3 LD4.A
  Bottom 0.305: R3.1 v26.1,7.3
N$3  (via drill 0.5)
  Top 0.508: v8.1,46.9 3.59,46.9 LD2.A
  Bottom 0.508: v8.1,46.9 7.05,47.95 R2.1
N$4
  Bottom 0.305: R14.1 6.41,61.48 7.62,62.68 7.6,62.7 7.6,64.4 8,64.8 11.2,64.8 Q1.3
N$5  (via drill 0.38)
  Top 0.305: v1.8,33.4 1.64,33.56 LD3.A
  Bottom 0.305: R13.1 2.09,34.59 1.7,34.2 1.7,33.5 v1.8,33.4
N$6  (via drill 0.38)
  Top 0.305: LD1.A 3.1,59.7 v5.5,59.7
  Bottom 0.305: R14.2 4.71,60.58 5.5,59.78 v5.5,59.7
N$7
  Bottom 0.508: D2.A 20.7,44.98 F3.2
N$8  (via drill 0.38)
  Top 0.305: v7.6,44 7.6,43.32 5.98,41.7 USB1.2
  Bottom 0.305: R16.2 6.06,43.26 6.8,44 v7.6,44
N$9  (1 unrouted)
N$11  (1 unrouted)
N$12  (1 unrouted)
N$20  (1 unrouted)
N$21  (1 unrouted)
N$22  (1 unrouted)
N$23  (via drill 0.38)
  Top 0.305: v7.7,37.3 6.46,38.55 6.46,40.28 5.68,41.05 4.29,41.05 USB1.3
  Bottom 0.305: v7.7,37.3 6.06,38.94 R15.2
N$24  (1 unrouted)
N$25  (1 unrouted)
N$26  (1 unrouted)
N$27  (1 unrouted)
N$28  (1 unrouted)
N$31
  Bottom 0.305: VR2.4 15.15,41.67 C20.1
RST_ETH  (via drill 0.38)
  Top 0.305: v12,28.9 12.7,28.2 12.7,26.94 MC1.27 | PB2.P$1 11.78,85.34 v11.07,85.34 | v4.6,50.9 4.5,51 4.5,55.7 v2,58.2
  Bottom 0.305: R4.2 8.55,28.9 v12,28.9 12.3,28.9 13.5,30.1 13.5,32.2 | v4.6,50.9 4.6,50 3,48.4 3,46.8 3.3,46.5 6.6,46.5 8.65,44.45 8.65,43.35 11.3,40.7 11.3,33.6 12.7,32.2 13.5,32.2 | 13.5,32.2 16.52,32.2 ETH1.11 | v11.07,85.34 1.9,76.17 1.9,58.3 v2,58.2
RST_MC  (via drill 0.38)
  Top 0.305: v4.2,69.3 2.4,69.3 1.9,68.8 PB1.P$1 | MC1.13 17.64,17.9 15.8,17.9 v15.3,17.4
  Bottom 0.305: v4.2,69.3 4.2,68.78 R1.2 5.6,67.04 5.6,65.3 3.5,63.2 3.5,60.2 4.41,59.29 4.41,52.6 1,49.2 1,32.81 1.4,32.41 1.4,11.1 3.6,8.9 22,8.9 23.2,10.1 23.2,13.2 19,17.4 v15.3,17.4
SCL  (via drill 0.38)  (8 unrouted)
  Top 0.305: H5.P$6 32.45,28.55 33.05,27.95 arc-90 33.1,28 33.8,28 34.3,28.5 34.3,29.8 32,32.1 28.8,32.1 28,32.9 25,32.9 24.1,33.8 24.1,34.7 24.9,35.5 26.64,35.5 27.5,36.36 27.5,40.3 30.25,43.05 | 21.9,82.85 21.9,83.8 22.5,84.4 25.9,84.4 28.2,82.1 28.2,73.05 29.1,72.15 H2.P$6 | v33.3,43.1 33.25,43.05 | H3.P$6 33.15,57.65 v33.3,57.6 | v33.3,70.45 33.3,71.25 32.4,72.15 | v16,20.6 16,21.3 16.59,21.89 | 29.65,28.55 v27.7,26.6 | v24.8,15.3 25.2,15.7 29.3,15.7 30.65,14.35 H6.P$6 32.15,14.35 v33.51,12.99
  Bottom 0.305: 33.79,57.09 35.2,55.6 35.2,44.4 33.9,43.1 v33.3,43.1 | 33.79,57.09 v33.3,57.6 | 33.05,70.7 v33.3,70.45 33.6,70.15 33.6,66.2 32.7,65.3 32.7,63.5 31.4,62.2 31.4,58.5 32.3,57.6 33.27,57.6 33.79,57.09 | v24.8,15.3 24.3,15.3 19.8,19.8 16.8,19.8 v16,20.6 | v33.51,12.99 32.4,14.1 32.4,17 33.3,17.9 33.3,24.7 31.4,26.6 v27.7,26.6
SCLK_ETH
  Top 0.305: MC1.9 14.25,14.35 14.3,14.3 14.3,11.44 ETH1.4
SCNN_ETH
  Top 0.305: MC1.8 13.45,13.45 11.05,11.05 11.05,10.05 12.5,8.6 15.85,8.6 ETH1.5
SDA  (via drill 0.38)  (8 unrouted)
  Top 0.305: H5.P$7 29.6,29.8 27.85,28.05 26.35,28.05 21.66,23.36 19.41,23.36 18.74,22.69 | H2.P$7 30.7,73.4 28.9,75.2 28.9,82.4 26.1,85.2 22.3,85.2 20.6,83.5 | v33.3,58.9 H3.P$7 | v33.3,44.4 31.4,44.4 | 33.2,29.8 v33.3,29.7 | v33.5,14.6 32.7,15.4 31.5,15.4 H6.P$7 | v28,50.9 28,56.5 30.4,58.9
  Bottom 0.305: v33.3,58.9 34.5,58.9 35,59.4 35,72.58 34.01,73.4 v33.3,73.4 33.25,73.4 32.55,74.1 | v33.3,29.7 33.3,25.7 34.2,24.8 | 34.2,24.8 34.2,24.3 | 34.2,24.3 34.2,18.8 34.1,18.7 34.8,18 34.8,15 34.4,14.6 v33.5,14.6 | 34.2,24.8 34.7,24.8 | 34.2,24.3 34.7,24.8 | 34.7,24.8 35.3,24.8 35.3,30.9 33.3,32.9 33.3,41.4 31.8,42.9 31.8,44 | 31.8,44 31.8,44.4 v33.3,44.4 | 31.8,44 28,47.8 v28,50.9
STATUS_PWM
  Top 0.305: MC1.30 10.2,26.93 10.2,29.2 11.1,30.1 11.1,31.4 12.25,32.55 15.65,32.55 18,34.9 18.5,34.9 21.2,37.6 21.2,38.8 LED1.4-DIN
UCAP  (via drill 0.38)
  Top 0.305: v11.6,13.45 11.85,13.7 MC1.6
  Bottom 0.305: C19.1 12.1,12.95 v11.6,13.45
UVCC
  Top 1.016: P1.2 7,56.27 7,63.75 F1.1
  Bottom 0.305: Q1.2 10.25,62.2 9,62.2 7.5,60.7 7.5,56.77 P1.2
VCC_1  (via drill 0.38)  (1 unrouted)
  Top 0.305: v26.35,36.7 23.05,40 19.36,40 19.31,40.05 | C13.1 19.31,40.05 | 19.31,40.05 17.2,42.16 17.2,43.3 v18.3,44.4 | F2.2 10.98,46.08
  Top 0.406: 10.98,46.08 v12.9,48
  Bottom 0.305: C11.1 26.25,74.1 | 26.25,74.1 26.25,78.33 F4.1 24.08,80.5 C10.1 | C11.1 27.65,70.7 R6.1 | R5.1 26.25,74.1 | v18.3,44.4 17,45.7 14.6,45.7 12.9,47.4 v12.9,48 | 26.35,23.93 C8.1 v26.35,36.7 26.35,39.13 F7.1 26.28,42.93 C9.1 26.35,52.47 | 26.35,23.93 C7.1 26.35,10.73 F9.1 | F8.1 26.35,23.93 | 26.25,68.17 C12.1 26.25,52.7 26.35,52.6 26.35,52.47 | 26.25,68.17 C11.1 | F5.1 26.25,68.17 | F6.1 26.35,52.47
VCC_2  (via drill 0.38)  (2 unrouted)
  Top 0.305: 8.31,17.09 MC1.44 6.05,16.85 v5.2,16 | 8.31,17.09 8.65,16.75 MC1.2 | v3.4,25.7 5.43,25.7 MC1.34 13.94,25.09 15.05,26.2 MC1.24 15.05,27.52 15.57,28.04 15.6,28.04 | C23.1 24.15,44.9 24.15,40.75 LED1.1-VDD 24.2,40.7 20.5,40.7 18.6,42.6 v18.3,42.6 | MC1.7 12.7,15.34 12.7,16.7 12.3,17.1 | MC1.14 13.89,18.69 v12.4,17.2 12.3,17.1 | 8.31,17.09 9.29,17.09 9.3,17.1 12.3,17.1 | v19.7,27.6 19.26,28.04 15.6,28.04 | 15.6,28.04 16,28.44 16,31.5 v18,33.5
  Bottom 0.305: D2.C 20.65,41.08 19.12,42.6 18.32,42.6 | 18.32,42.6 16.96,43.96 14.84,43.96 13.19,45.61 | C16.1 16.39,13.21 v12.4,17.2 | v19.7,27.6 18.78,26.68 C17.1 | R1.1 11.79,67.21 13.39,65.61 13.39,51.48 D1.C 10.59,48.21 13.19,45.61 | 15.15,35.3 VR2.3 14.96,36.4 13.9,36.4 12.7,37.6 12.7,41.83 13.19,42.31 13.19,45.61 | 15.15,35.3 15.15,34.51 C5.1 15.06,33.5 v18,33.5 | 15.15,35.3 16.3,35.3 17.05,36.05 VR2.1 | R4.1 5.1,27.4 v3.4,25.7 | v5.2,16 6.11,15.1 C15.1 7,15.19 7,22.6 3.9,25.7 v3.4,25.7 | C14.1 2.97,26.13 v3.4,25.7 | 18.32,42.6 v18.3,42.6
VCC_LDR0  (via drill 0.38)
  Top 0.305: v26.9,82 26.4,82 H1.P$3
  Bottom 0.305: F4.2 26.9,80.52 v26.9,82
VCC_LDR1  (via drill 0.38)
  Top 0.305: v32.1,66.8 32.1,67.6 H2.P$3
  Bottom 0.305: v32.1,66.8 30.5,68.4 29.32,68.4 F5.2
VCC_LDR2  (via drill 0.38)
  Top 0.305: H3.P$3 32,53.2 v32,52.6
  Bottom 0.305: v32,52.6 F6.2
VCC_LDR3  (via drill 0.38)
  Top 0.305: H4.P$3 31.3,39.2 v29.1,37
  Bottom 0.305: F7.2 29.12,37.02 v29.1,37
VCC_LDR4  (via drill 0.38)
  Top 0.305: H5.P$3 31.9,24.2 v31.9,23.9
  Bottom 0.305: F8.2 31.8,23.8 v31.9,23.9
VCC_LDR5  (via drill 0.38)
  Top 0.305: H6.P$3 32,9.9 v32,9.1
  Bottom 0.305: F9.2 29.32,9.33 29.55,9.1 v32,9.1
VIN  (via drill 0.5)
  Top 0.406: F1.2 13.95,63.6 TP1.TP
  Top 0.508: VR1.2 VR1.1 | C24.+ 15.2,47.22 15.2,48.9 13.3,50.8 v10.9,50.8 | VR1.1 8.77,60.17 v8.6,60 | VR1.1 10.92,63.58 F1.2
  Bottom 0.508: v10.9,50.8 11.7,51.6 11.7,56.9 v8.6,60 9.6,61 10.95,61 Q1.1
XTAL1  (via drill 0.38)
  Top 0.305: v24.5,22.9 24.3,22.9 X1.1 21.5,22.7 19.8,22.7 19,21.9 19,21.5 18.59,21.09 MC1.17
  Bottom 0.305: v24.5,22.9 24.5,21.93 C3.1
XTAL2  (via drill 0.38)
  Top 0.305: MC1.16 20.11,20.29 X1.3 22.2,18.2 v23.3,18.2
  Bottom 0.305: v23.3,18.2 22.9,18.2 22.07,19.03 C4.1

### Text on the board
tPlace: EN0 | ETH_RESET | LIDAR_0 | EN1 | 5VDC_REG | LIDAR_1 | EN2 | FUSE | MC_RST | 5-13VDC | LIDAR_2 | EN3 | 5V | PGRM | LIDAR_3 | EN4 | 3V | LIDAR_4 | EN5 | LIDAR_5 | RoboRacing | I2C_ACT | LIDAR BREAKOUT / VERSION: 1.0 2019